# Altium schematic sheet DSP2.SchDoc
size A
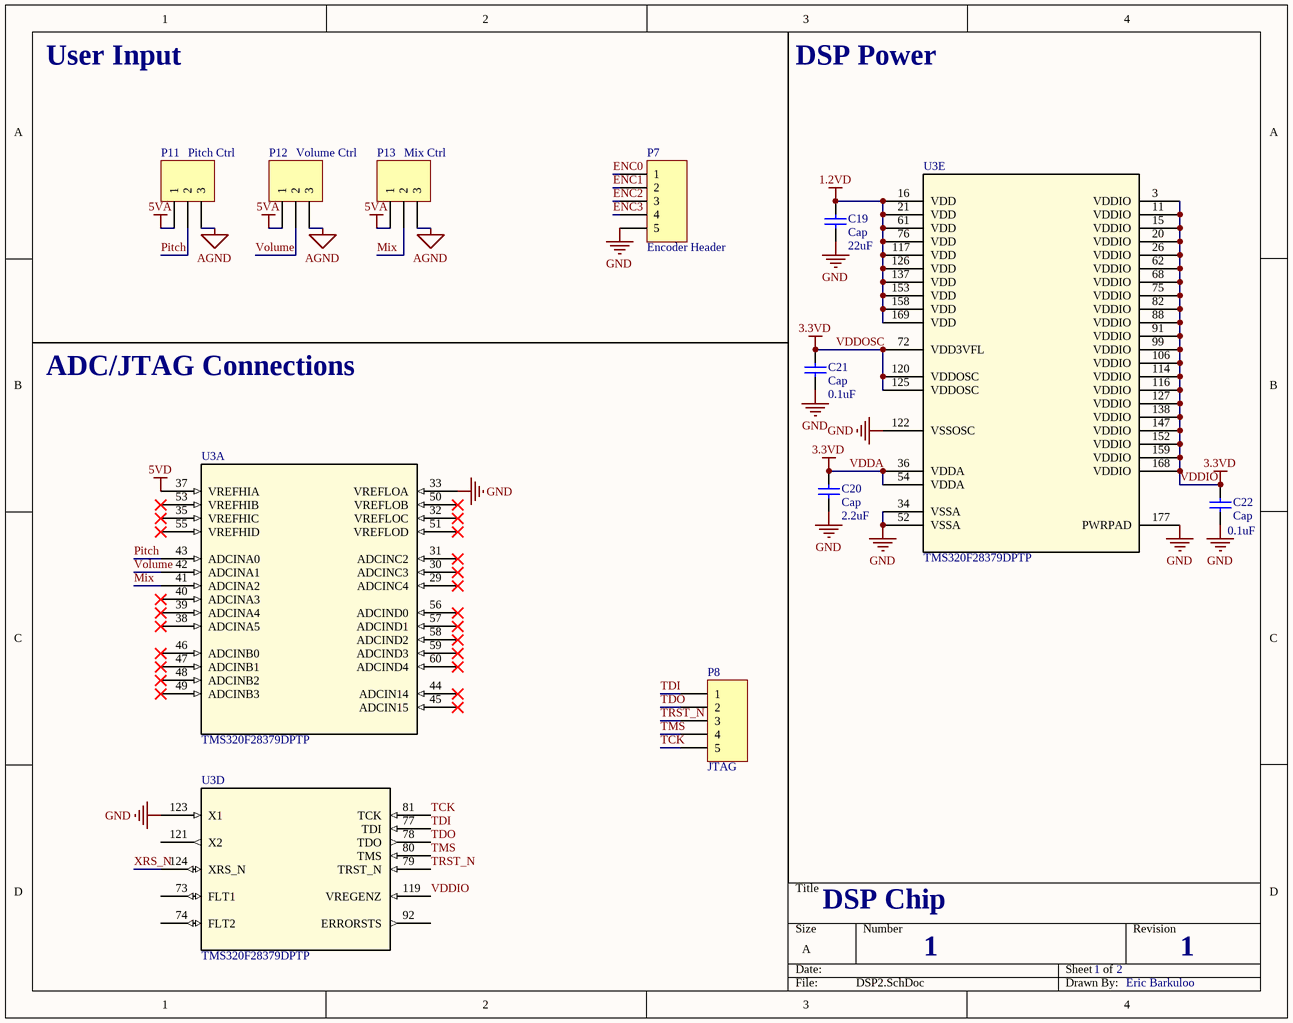
[diagram p0: DSP2.SchDoc]

## Parts
C19  Cap  value 22uF  [CAPC0805]
C20  Cap  value 2.2uF  [CAPC0805]
C21  Cap  value 0.1uF  [CAPC0805]
C22  Cap  value 0.1uF  [CAPC0805]
P7  Encoder Header  [HDR1X5]
P8  JTAG  [HDR1X5]
P11  Pitch Ctrl  [HDR1X3]
P12  Volume Ctrl  [HDR1X3]
P13  Mix Ctrl  [HDR1X3]
U3  TMS320F28379DPTP  [PTP0176F_N]  (parts A,D,E of 5)

## Nets
1.2VD: C19.2 U3.16(VDD) U3.21(VDD) U3.61(VDD) U3.76(VDD) U3.117(VDD) U3.126(VDD) U3.137(VDD) U3.153(VDD) U3.158(VDD) U3.169(VDD)
5VA: P11.1 P12.1 P13.1
5VD: U3.37(VREFHIA)
AGND: P11.3 P12.3 P13.3
GND: C19.1 C20.1 C21.1 C22.1 P7.5 U3.33(VREFLOA) U3.34(VSSA) U3.52(VSSA) U3.122(VSSOSC) U3.123(X1) U3.177(PWRPAD)
VDDA: C20.2 C21.2 C22.2 U3.3(VDDIO) U3.11(VDDIO) U3.15(VDDIO) U3.20(VDDIO) U3.26(VDDIO) U3.36(VDDA) U3.54(VDDA) U3.62(VDDIO) U3.68(VDDIO) U3.72(VDD3VFL) U3.75(VDDIO) U3.82(VDDIO) U3.88(VDDIO) U3.91(VDDIO) U3.99(VDDIO) U3.106(VDDIO) U3.114(VDDIO) U3.116(VDDIO) U3.119(VREGENZ) U3.120(VDDOSC) U3.125(VDDOSC) U3.127(VDDIO) U3.138(VDDIO) U3.147(VDDIO) U3.152(VDDIO) U3.159(VDDIO) U3.168(VDDIO)  [also labelled 3.3VD, VDDIO, VDDOSC]
ENC0: P7.1
ENC1: P7.2
ENC2: P7.3
ENC3: P7.4
Mix: P13.2 U3.41(ADCINA2)
Pitch: P11.2 U3.43(ADCINA0)
TCK: P8.5 U3.81(TCK)
TDI: P8.1 U3.77(TDI)
TDO: P8.2 U3.78(TDO)
TMS: P8.4 U3.80(TMS)
TRST_N: P8.3 U3.79(TRST_N)
Volume: P12.2 U3.42(ADCINA1)
XRS_N: U3.124(XRS_N)

Not connected (* = marked no-connect by the designer): U3 29(ADCINC4)* 30(ADCINC3)* 31(ADCINC2)* 32(VREFLOC)* 35(VREFHIC)* 38(ADCINA5)* 39(ADCINA4)* 40(ADCINA3)* 44(ADCIN14)* 45(ADCIN15)* 46(ADCINB0)* 47(ADCINB1)* 48(ADCINB2)* 49(ADCINB3)* 50(VREFLOB)* 51(VREFLOD)* 53(VREFHIB)* 55(VREFHID)* 56(ADCIND0)* 57(ADCIND1)* 58(ADCIND2)* 59(ADCIND3)* 60(ADCIND4)* 73(FLT1) 74(FLT2) 92(ERRORSTS) 121(X2)

## Notes on the sheet
- User Input
- DSP Power
- ADC/JTAG Connections
- DSP Chip
- 1
- 2
- Eric Barkuloo

## Library data of the parts
C19-C22 = Cap: Capacitor; Published: 8-Jun-2000; LatestRevisionDate: 17-Jul-2002; LatestRevisionNote: Re-released for DXP Platform.; PackageReference: RAD-0.3; Publisher: Altium Limited; PackageDescription: Radial Cap, Thru-Hole; 2 Leads; 0.3 in Pin Spacing
P7 P8 = Header 5: Header, 5-Pin; LatestRevisionDate: 17-Jul-2002; LatestRevisionNote: Re-released for DXP Platform.; Publisher: Altium Limited
P11-P13 = Header 3: Header, 3-Pin; LatestRevisionDate: 17-Jul-2002; LatestRevisionNote: Re-released for DXP Platform.; Publisher: Altium Limited
U3 = TMS320F28379DPTP: Imported; PartNumber: TMS320F28379DPTPS; Manufacturer: Texas Instruments; RefDes: RefDes; TYPE: TYPE; Value: Value